# EAGLE schematic gyro_pcb (EAGLE 7.5.0)
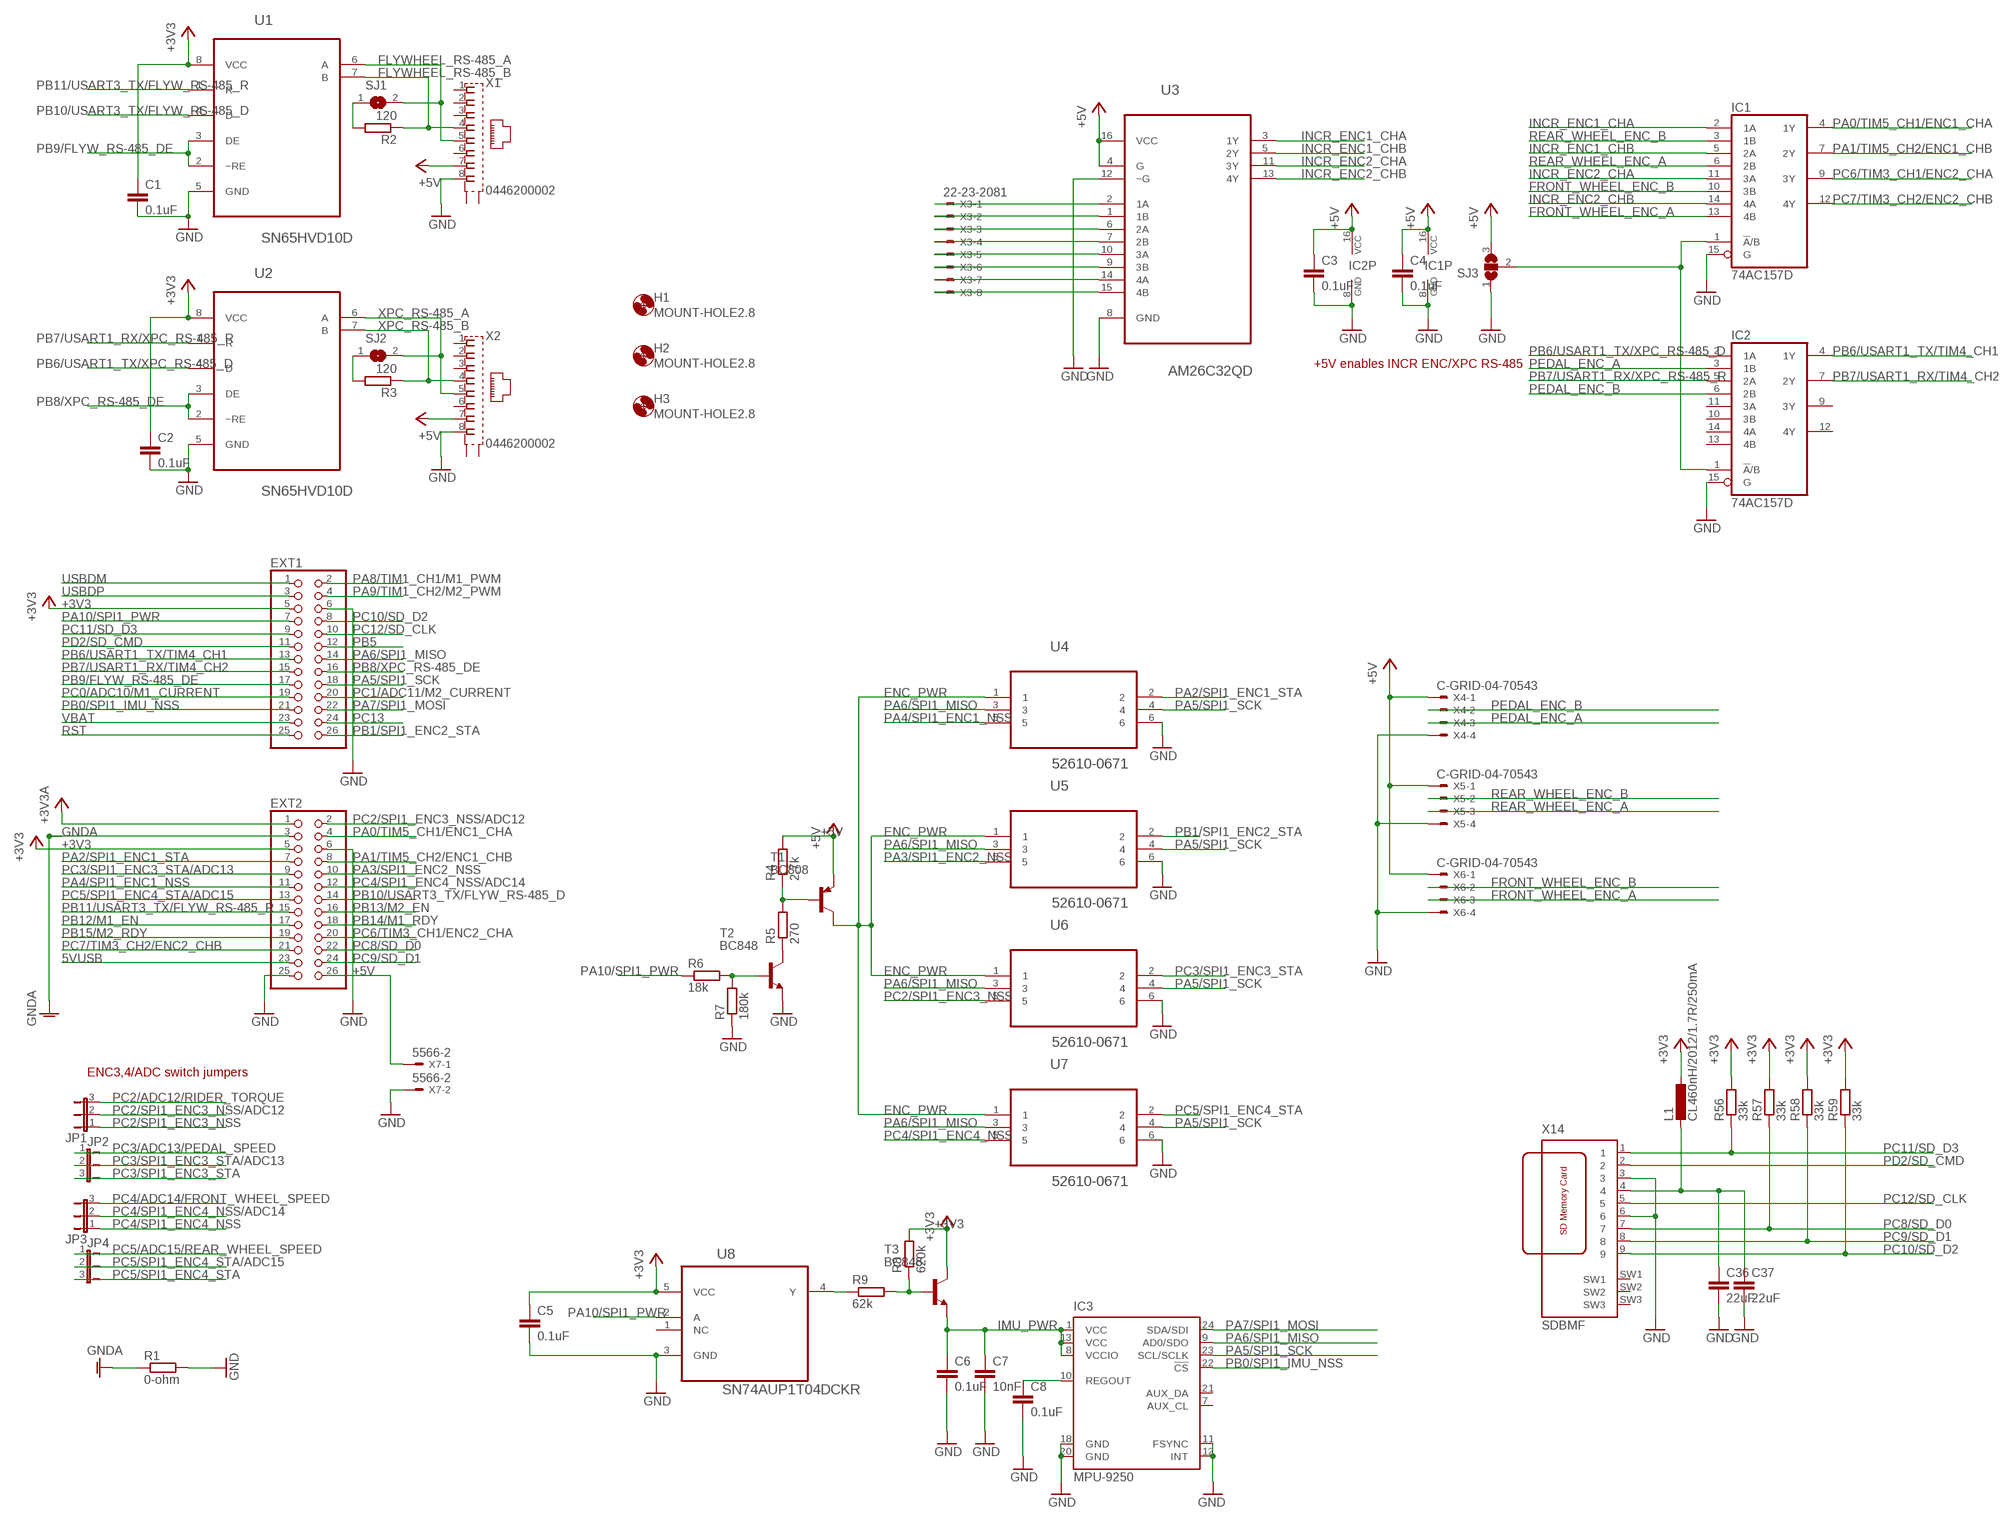
[diagram p0: schematic, sheet 1, part 1 of 2]
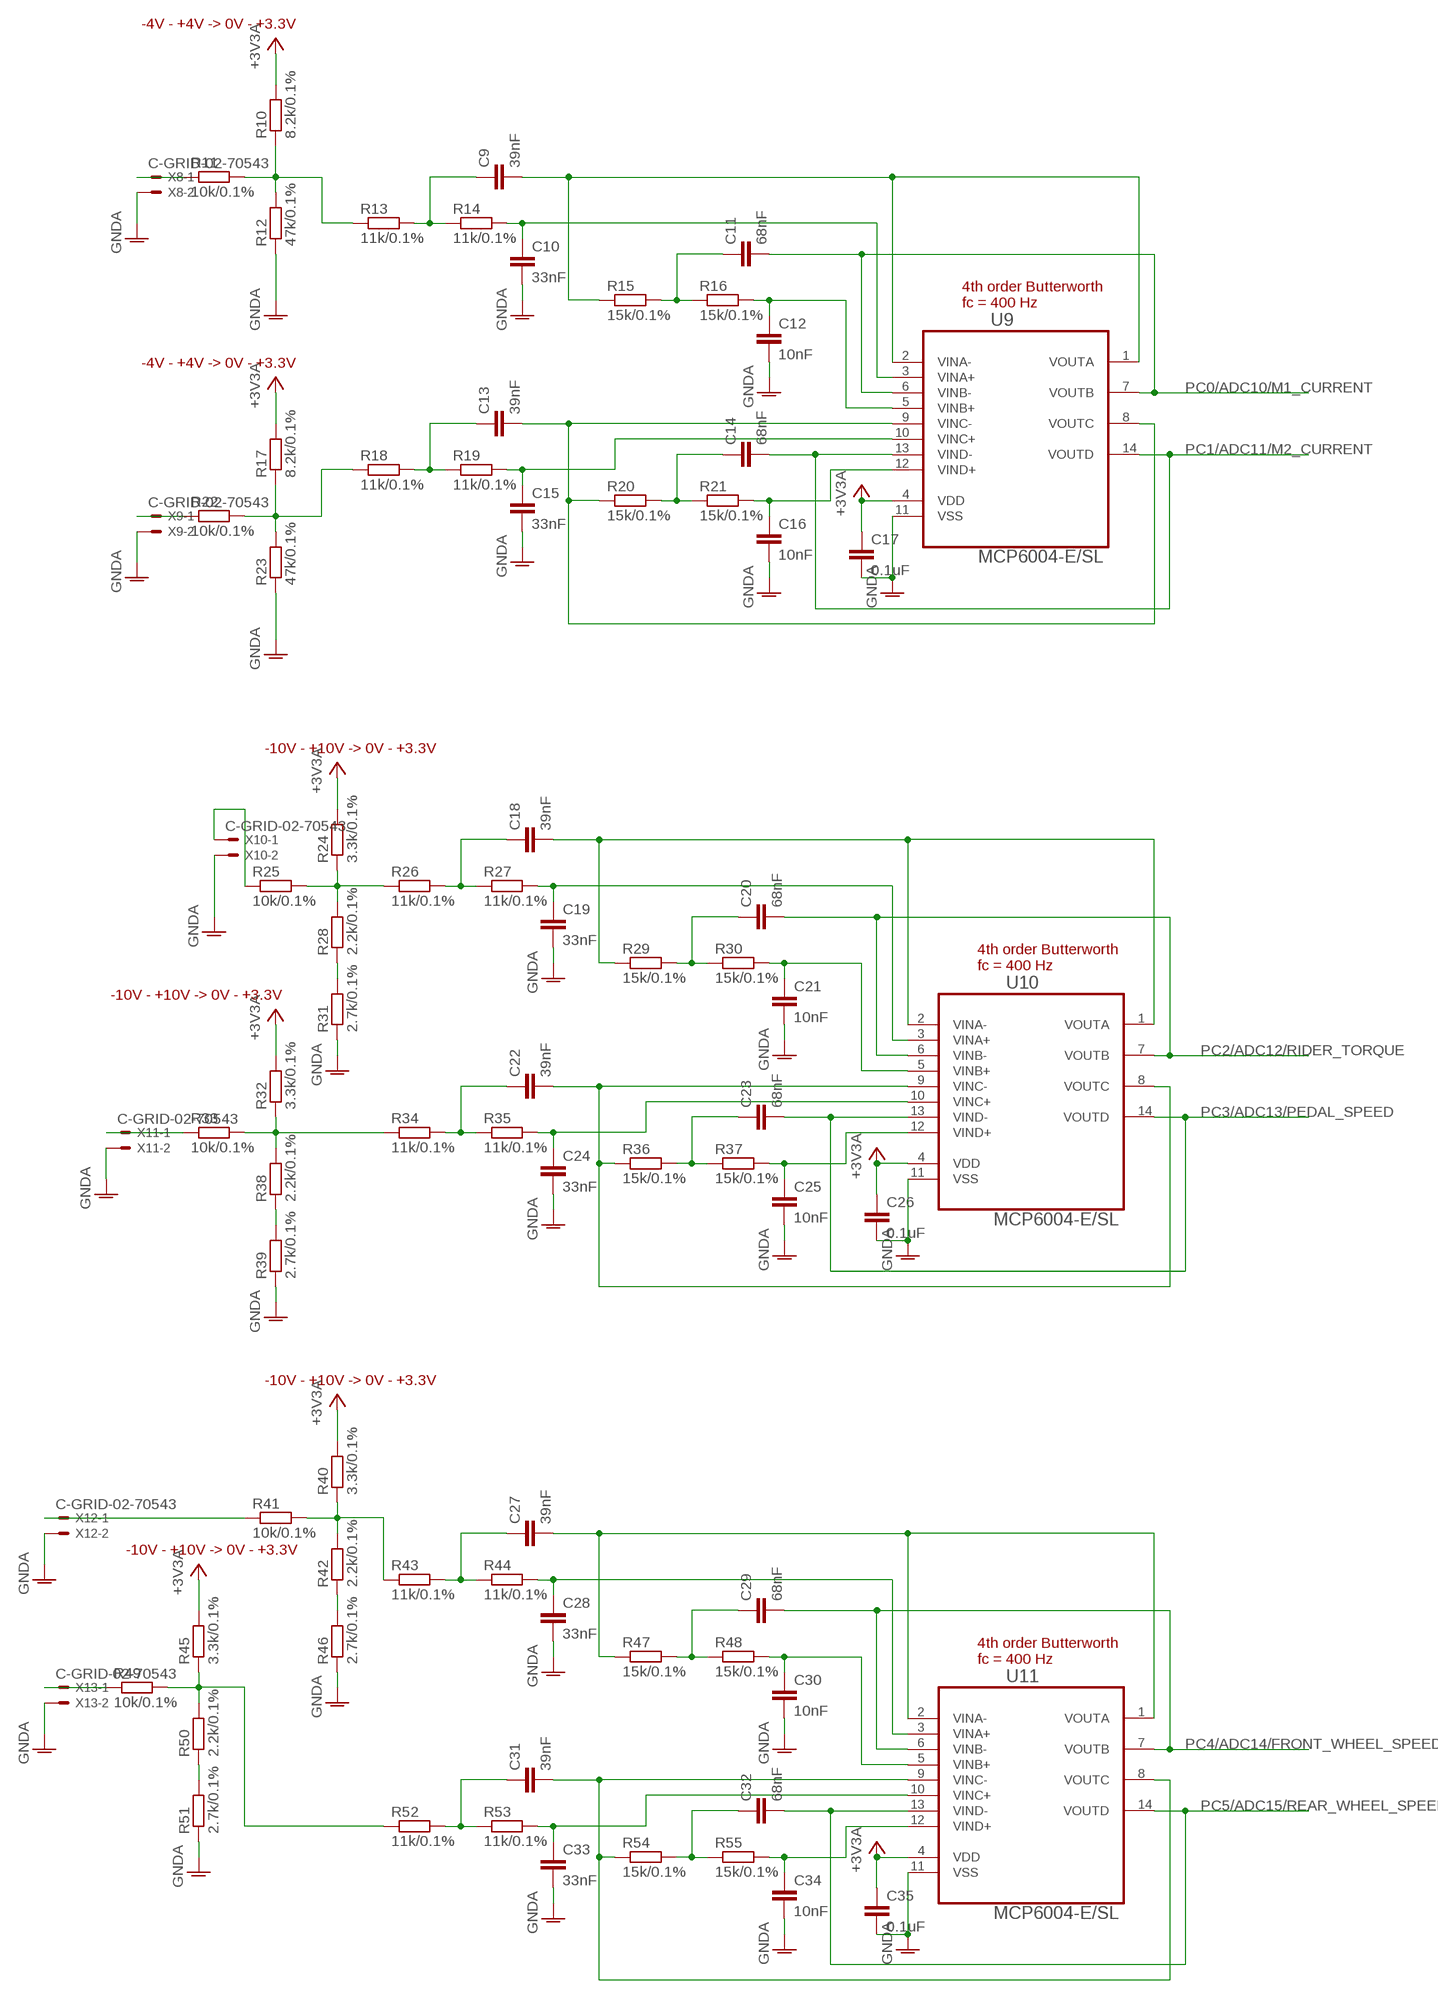
[diagram p1: schematic, sheet 1, part 2 of 2]

## Parts
C1  0.1uF  C-EUC0603  [C0603]
C2  0.1uF  C-EUC0603  [C0603]
C3  0.1uF  C-EUC0603  [C0603]
C4  0.1uF  C-EUC0603  [C0603]
C5  0.1uF  C-EUC0603  [C0603]
C6  0.1uF  C-EUC0603  [C0603]
C7  10nF  C-EUC0603  [C0603]
C8  0.1uF  C-EUC0603  [C0603]
C9  39nF  C-EUC0603  [C0603]
C10  33nF  C-EUC0603  [C0603]
C11  68nF  C-EUC0603  [C0603]
C12  10nF  C-EUC0603  [C0603]
C13  39nF  C-EUC0603  [C0603]
C14  68nF  C-EUC0603  [C0603]
C15  33nF  C-EUC0603  [C0603]
C16  10nF  C-EUC0603  [C0603]
C17  0.1uF  C-EUC0603  [C0603]
C18  39nF  C-EUC0603  [C0603]
C19  33nF  C-EUC0603  [C0603]
C20  68nF  C-EUC0603  [C0603]
C21  10nF  C-EUC0603  [C0603]
C22  39nF  C-EUC0603  [C0603]
C23  68nF  C-EUC0603  [C0603]
C24  33nF  C-EUC0603  [C0603]
C25  10nF  C-EUC0603  [C0603]
C26  0.1uF  C-EUC0603  [C0603]
C27  39nF  C-EUC0603  [C0603]
C28  33nF  C-EUC0603  [C0603]
C29  68nF  C-EUC0603  [C0603]
C30  10nF  C-EUC0603  [C0603]
C31  39nF  C-EUC0603  [C0603]
C32  68nF  C-EUC0603  [C0603]
C33  33nF  C-EUC0603  [C0603]
C34  10nF  C-EUC0603  [C0603]
C35  0.1uF  C-EUC0603  [C0603]
C36  22uF  C-EUC0603  [C0603]
C37  22uF  C-EUC0603  [C0603]
EXT1  PINHD-2X13  [2X13]
EXT2  PINHD-2X13  [2X13]
H1  MOUNT-HOLE2.8  [2,8]
H2  MOUNT-HOLE2.8  [2,8]
H3  MOUNT-HOLE2.8  [2,8]
IC1  74AC157D  [SO16]
IC2  74AC157D  [SO16]
IC3  MPU-9250  [QFN24-SMALL]
JP1  JP2E  [JP2]
JP2  JP2E  [JP2]
JP3  JP2E  [JP2]
JP4  JP2E  [JP2]
L1  CL460nH/2012/1.7R/250mA  L-EUL2825P  [L2825P]
R1  0-ohm  R-EU_R1218  [R1218]
R2  120  R-EU_R0603  [R0603]
R3  120  R-EU_R0603  [R0603]
R4  2.7k  R-EU_R1210  [R1210]
R5  270  R-EU_R1210  [R1210]
R6  18k  R-EU_R0603  [R0603]
R7  180k  R-EU_R0603  [R0603]
R8  620k  R-EU_R0603  [R0603]
R9  62k  R-EU_R0603  [R0603]
R10  8.2k/0.1%  R-EU_R0603  [R0603]
R11  10k/0.1%  R-EU_R0603  [R0603]
R12  47k/0.1%  R-EU_R0603  [R0603]
R13  11k/0.1%  R-EU_R0603  [R0603]
R14  11k/0.1%  R-EU_R0603  [R0603]
R15  15k/0.1%  R-EU_R0603  [R0603]
R16  15k/0.1%  R-EU_R0603  [R0603]
R17  8.2k/0.1%  R-EU_R0603  [R0603]
R18  11k/0.1%  R-EU_R0603  [R0603]
R19  11k/0.1%  R-EU_R0603  [R0603]
R20  15k/0.1%  R-EU_R0603  [R0603]
R21  15k/0.1%  R-EU_R0603  [R0603]
R22  10k/0.1%  R-EU_R0603  [R0603]
R23  47k/0.1%  R-EU_R0603  [R0603]
R24  3.3k/0.1%  R-EU_R0603  [R0603]
R25  10k/0.1%  R-EU_R0603  [R0603]
R26  11k/0.1%  R-EU_R0603  [R0603]
R27  11k/0.1%  R-EU_R0603  [R0603]
R28  2.2k/0.1%  R-EU_R0603  [R0603]
R29  15k/0.1%  R-EU_R0603  [R0603]
R30  15k/0.1%  R-EU_R0603  [R0603]
R31  2.7k/0.1%  R-EU_R0603  [R0603]
R32  3.3k/0.1%  R-EU_R0603  [R0603]
R33  10k/0.1%  R-EU_R0603  [R0603]
R34  11k/0.1%  R-EU_R0603  [R0603]
R35  11k/0.1%  R-EU_R0603  [R0603]
R36  15k/0.1%  R-EU_R0603  [R0603]
R37  15k/0.1%  R-EU_R0603  [R0603]
R38  2.2k/0.1%  R-EU_R0603  [R0603]
R39  2.7k/0.1%  R-EU_R0603  [R0603]
R40  3.3k/0.1%  R-EU_R0603  [R0603]
R41  10k/0.1%  R-EU_R0603  [R0603]
R42  2.2k/0.1%  R-EU_R0603  [R0603]
R43  11k/0.1%  R-EU_R0603  [R0603]
R44  11k/0.1%  R-EU_R0603  [R0603]
R45  3.3k/0.1%  R-EU_R0603  [R0603]
R46  2.7k/0.1%  R-EU_R0603  [R0603]
R47  15k/0.1%  R-EU_R0603  [R0603]
R48  15k/0.1%  R-EU_R0603  [R0603]
R49  10k/0.1%  R-EU_R0603  [R0603]
R50  2.2k/0.1%  R-EU_R0603  [R0603]
R51  2.7k/0.1%  R-EU_R0603  [R0603]
R52  11k/0.1%  R-EU_R0603  [R0603]
R53  11k/0.1%  R-EU_R0603  [R0603]
R54  15k/0.1%  R-EU_R0603  [R0603]
R55  15k/0.1%  R-EU_R0603  [R0603]
R56  33k  R-EU_R0603  [R0603]
R57  33k  R-EU_R0603  [R0603]
R58  33k  R-EU_R0603  [R0603]
R59  33k  R-EU_R0603  [R0603]
SJ1  SJ  [SJ]
SJ2  SJ  [SJ]
SJ3  SJ2W  [SJ_2]
T1  BC808  BC808-16-PNP-SOT23-BEC  [SOT23-BEC]
T2  BC848  [SOT23]
T3  BC848  [SOT23]
U1  SN65HVD10D  [SOIC127P600X175-8N]
U2  SN65HVD10D  [SOIC127P600X175-8N]
U3  AM26C32QD  [SOIC127P600X175-16N]
U4  52610-0671  [MOLEX_52610-0671]
U5  52610-0671  [MOLEX_52610-0671]
U6  52610-0671  [MOLEX_52610-0671]
U7  52610-0671  [MOLEX_52610-0671]
U8  SN74AUP1T04DCKR  [SOT65P210X110-5N]
U9  MCP6004-E/SL  [SOIC127P600X175-14N]
U10  MCP6004-E/SL  [SOIC127P600X175-14N]
U11  MCP6004-E/SL  [SOIC127P600X175-14N]
X1  0446200002  [0446200002]
X2  0446200002  [0446200002]
X3  22-23-2081  [22-23-2081]
X4  C-GRID-04-70543  [70543-04]
X5  C-GRID-04-70543  [70543-04]
X6  C-GRID-04-70543  [70543-04]
X7  5566-2  [5566-2]
X8  C-GRID-02-70543  [70543-02]
X9  C-GRID-02-70543  [70543-02]
X10  C-GRID-02-70543  [70543-02]
X11  C-GRID-02-70543  [70543-02]
X12  C-GRID-02-70543  [70543-02]
X13  C-GRID-02-70543  [70543-02]
X14  SDBMF  [SDBMF-009XXBXX2]

## Nets
5VUSB: EXT2.23
+3V3: C1.1 C2.1 C5.1 EXT1.5 EXT2.5 L1.1 R8.2 R56.2 R57.2 R58.2 R59.2 T3.3(C) U1.8(VCC) U2.8(VCC) U8.5(VCC)
+3V3A: C17.1 C26.1 C35.1 EXT2.1 R10.2 R17.2 R24.2 R32.2 R40.2 R45.2 U9.4(VDD) U10.4(VDD) U11.4(VDD)
+5V: C3.1 C4.1 EXT2.26 IC1.16(VCC) IC2.16(VCC) R4.2 SJ3.3 T1.E U3.4(G) U3.16(VCC) X1.7 X2.7 X4.1 X5.1 X6.1 X7.1
ENC1_CHA+: U3.1(1B) X3.2
ENC1_CHA-: U3.2(1A) X3.1
ENC1_CHB+: U3.7(2B) X3.4
ENC1_CHB-: U3.6(2A) X3.3
ENC2_CHA+: U3.9(3B) X3.6
ENC2_CHA-: U3.10(3A) X3.5
ENC2_CHB+: U3.15(4B) X3.8
ENC2_CHB-: U3.14(4A) X3.7
ENC_PWR: T1.C U4.1 U5.1 U6.1 U7.1
FLYWHEEL_RS-485_A: SJ1.2 U1.6(A) X1.5
FLYWHEEL_RS-485_B: R2.1 U1.7(B) X1.4
FRONT_WHEEL_ENC_A: IC1.13(4B) X6.3
FRONT_WHEEL_ENC_B: IC1.10(3B) X6.2
GND: C1.2 C2.2 C3.2 C4.2 C5.2 C6.2 C7.2 C8.2 C36.2 C37.2 EXT1.6 EXT2.6 EXT2.25 IC1.8(GND) IC1.15(G) IC2.8(GND) IC2.15(G) IC3.11(FSYNC) IC3.12(INT) IC3.18(GND) IC3.20(GND) R1.2 R7.1 SJ3.1 T2.2(E) U1.5(GND) U2.5(GND) U3.8(GND) U3.12(~G) U4.6 U5.6 U6.6 U7.6 U8.3(GND) X1.8 X2.8 X4.4 X5.4 X6.4 X7.2 X14.3 X14.6
GNDA: C10.2 C12.2 C15.2 C16.2 C17.2 C19.2 C21.2 C24.2 C25.2 C26.2 C28.2 C30.2 C33.2 C34.2 C35.2 EXT2.3 R1.1 R12.1 R23.1 R31.1 R39.1 R46.1 R51.1 U9.11(VSS) U10.11(VSS) U11.11(VSS) X8.2 X9.2 X10.2 X11.2 X12.2 X13.2
IMU_PWR: C6.1 C7.1 IC3.1(VCC) IC3.8(VCCIO) IC3.13(VCC) T3.2(E)
INCR_ENC1_CHA: IC1.2(1A) U3.3(1Y)
INCR_ENC1_CHB: IC1.5(2A) U3.5(2Y)
INCR_ENC2_CHA: IC1.11(3A) U3.11(3Y)
INCR_ENC2_CHB: IC1.14(4A) U3.13(4Y)
N$1: C8.1 IC3.10(REGOUT)
N$2: R8.1 R9.2 T3.1(B)
N$3: R4.1 R5.2 T1.B
N$4: R5.1 T2.3(C)
N$5: R6.2 R7.2 T2.1(B)
N$6: R28.1 R31.2
N$7: C18.1 R26.2 R27.1
N$8: C19.1 R27.2 U10.3(VINA+)
N$9: C18.2 R29.1 U10.1(VOUTA) U10.2(VINA-)
N$10: R24.1 R25.2 R26.1 R28.2
N$11: C22.1 R34.2 R35.1
N$12: C24.1 R35.2 U10.10(VINC+)
N$13: C22.2 R36.1 U10.8(VOUTC) U10.9(VINC-)
N$14: C23.1 R36.2 R37.1
N$15: R10.1 R11.2 R12.2 R13.1
N$16: R22.1 X9.1
N$17: R32.1 R33.2 R34.1 R38.2
N$18: C25.1 R37.2 U10.12(VIND+)
N$19: C36.1 C37.1 L1.2 X14.4
N$20: R2.2 SJ1.1
N$21: C9.1 R13.2 R14.1
N$22: C21.1 R30.2 U10.5(VINB+)
N$23: C20.1 R29.2 R30.1
N$24: R3.2 SJ2.1
N$25: C27.1 R43.2 R44.1
N$26: C28.1 R44.2 U11.3(VINA+)
N$27: C27.2 R47.1 U11.1(VOUTA) U11.2(VINA-)
N$28: C10.1 R14.2 U9.3(VINA+)
N$29: C9.2 R15.1 U9.1(VOUTA) U9.2(VINA-)
N$31: C12.1 R16.2 U9.5(VINB+)
N$32: C13.1 R18.2 R19.1
N$33: C15.1 R19.2 U9.10(VINC+)
N$34: C13.2 R20.1 U9.8(VOUTC) U9.9(VINC-)
N$35: C14.1 R20.2 R21.1
N$36: C16.1 R21.2 U9.12(VIND+)
N$37: R9.1 U8.4(Y)
N$38: C31.1 R52.2 R53.1
N$39: C33.1 R53.2 U11.10(VINC+)
N$40: C31.2 R54.1 U11.8(VOUTC) U11.9(VINC-)
N$41: C32.1 R54.2 R55.1
N$42: R49.1 X13.1
N$43: C34.1 R55.2 U11.12(VIND+)
N$44: C30.1 R48.2 U11.5(VINB+)
N$45: R17.1 R18.1 R22.2 R23.2
N$46: C29.1 R47.2 R48.1
N$47: R41.1 X12.1
N$48: C11.1 R15.2 R16.1
N$49: IC1.1(!A!/B) IC2.1(!A!/B) SJ3.2
N$50: R25.1 X10.1
N$53: R11.1 X8.1
N$58: R38.1 R39.2
N$59: R40.1 R41.2 R42.2 R43.1
N$60: R42.1 R46.2
N$61: R45.1 R49.2 R50.2 R52.1
N$62: R50.1 R51.2
N$63: R33.1 X11.1
PA0/TIM5_CH1/ENC1_CHA: EXT2.4 IC1.4(1Y)
PA1/TIM5_CH2/ENC1_CHB: EXT2.8 IC1.7(2Y)
PA2/SPI1_ENC1_STA: EXT2.7 U4.2
PA3/SPI1_ENC2_NSS: EXT2.10 U5.5
PA4/SPI1_ENC1_NSS: EXT2.11 U4.5
PA5/SPI1_SCK: EXT1.18 IC3.23(SCL/SCLK) U4.4 U5.4 U6.4 U7.4
PA6/SPI1_MISO: EXT1.14 IC3.9(AD0/SDO) U4.3 U5.3 U6.3 U7.3
PA7/SPI1_MOSI: EXT1.22 IC3.24(SDA/SDI)
PA8/TIM1_CH1/M1_PWM: EXT1.2
PA9/TIM1_CH2/M2_PWM: EXT1.4
PA10/SPI1_PWR: EXT1.7 R6.1 U8.2(A)
PB0/SPI1_IMU_NSS: EXT1.21 IC3.22(!CS)
PB1/SPI1_ENC2_STA: EXT1.26 U5.2
PB5: EXT1.12
PB6/USART1_TX/TIM4_CH1: EXT1.13 IC2.4(1Y)
PB6/USART1_TX/XPC_RS-485_D: IC2.2(1A) U2.4(D)
PB7/USART1_RX/TIM4_CH2: EXT1.15 IC2.7(2Y)
PB7/USART1_RX/XPC_RS-485_R: IC2.5(2A) U2.1(R)
PB8/XPC_RS-485_DE: EXT1.16 U2.2(~RE) U2.3(DE)
PB9/FLYW_RS-485_DE: EXT1.17 U1.2(~RE) U1.3(DE)
PB10/USART3_TX/FLYW_RS-485_D: EXT2.14 U1.4(D)
PB11/USART3_TX/FLYW_RS-485_R: EXT2.15 U1.1(R)
PB12/M1_EN: EXT2.17
PB13/M2_EN: EXT2.16
PB14/M1_RDY: EXT2.18
PB15/M2_RDY: EXT2.19
PC0/ADC10/M1_CURRENT: C11.2 EXT1.19 U9.6(VINB-) U9.7(VOUTB)
PC1/ADC11/M2_CURRENT: C14.2 EXT1.20 U9.13(VIND-) U9.14(VOUTD)
PC2/ADC12/RIDER_TORQUE: C20.2 JP1.3 U10.6(VINB-) U10.7(VOUTB)
PC2/SPI1_ENC3_NSS: JP1.1 U6.5
PC2/SPI1_ENC3_NSS/ADC12: EXT2.2 JP1.2
PC3/ADC13/PEDAL_SPEED: C23.2 JP2.1 U10.13(VIND-) U10.14(VOUTD)
PC3/SPI1_ENC3_STA: JP2.3 U6.2
PC3/SPI1_ENC3_STA/ADC13: EXT2.9 JP2.2
PC4/ADC14/FRONT_WHEEL_SPEED: C29.2 JP3.3 U11.6(VINB-) U11.7(VOUTB)
PC4/SPI1_ENC4_NSS: JP3.1 U7.5
PC4/SPI1_ENC4_NSS/ADC14: EXT2.12 JP3.2
PC5/ADC15/REAR_WHEEL_SPEED: C32.2 JP4.1 U11.13(VIND-) U11.14(VOUTD)
PC5/SPI1_ENC4_STA: JP4.3 U7.2
PC5/SPI1_ENC4_STA/ADC15: EXT2.13 JP4.2
PC6/TIM3_CH1/ENC2_CHA: EXT2.20 IC1.9(3Y)
PC7/TIM3_CH2/ENC2_CHB: EXT2.21 IC1.12(4Y)
PC8/SD_D0: EXT2.22 R57.1 X14.7
PC9/SD_D1: EXT2.24 R58.1 X14.8
PC10/SD_D2: EXT1.8 R59.1 X14.9
PC11/SD_D3: EXT1.9 R56.1 X14.1
PC12/SD_CLK: EXT1.10 X14.5
PC13: EXT1.24
PD2/SD_CMD: EXT1.11 X14.2
PEDAL_ENC_A: IC2.3(1B) X4.3
PEDAL_ENC_B: IC2.6(2B) X4.2
REAR_WHEEL_ENC_A: IC1.6(2B) X5.3
REAR_WHEEL_ENC_B: IC1.3(1B) X5.2
RST: EXT1.25
USBDM: EXT1.1
USBDP: EXT1.3
VBAT: EXT1.23
XPC_RS-485_A: SJ2.2 U2.6(A) X2.5
XPC_RS-485_B: R3.1 U2.7(B) X2.4
Unconnected: IC2.9(3Y) IC2.10(3B) IC2.11(3A) IC2.12(4Y) IC2.13(4B) IC2.14(4A) IC3.7(AUX_CL) IC3.21(AUX_DA) U8.1(NC) X1.1 X1.2 X1.3 X1.6 X1.S@1(S1) X1.S@2(S2) X2.1 X2.2 X2.3 X2.6 X2.S@1(S1) X2.S@2(S2) X14.SW1 X14.SW2 X14.SW3

## Notes on the sheet
- -4V - +4V -> 0V - +3.3V
- 4th order Butterworth
  fc = 400 Hz
- +5V enables INCR ENC/XPC RS-485
- -4V - +4V -> 0V - +3.3V
- -10V - +10V -> 0V - +3.3V
- 4th order Butterworth
  fc = 400 Hz
- -10V - +10V -> 0V - +3.3V
- ENC3,4/ADC switch jumpers
- -10V - +10V -> 0V - +3.3V
- -10V - +10V -> 0V - +3.3V
- 4th order Butterworth
  fc = 400 Hz

## Library data of the parts
C1-C37 = rcl:C-EU: CAPACITOR, European symbol
EXT1 EXT2 = pinhead:PINHD-2X13: PIN HEADER
H1-H3 = holes:MOUNT-HOLE: MOUNTING HOLE with drill center marker
IC1 IC2 = 74xx-eu:74*157: Quadruple 2-line to 1-line data SELECTOR/MULTIPLEXER
IC3 = invensense:MPU-9250: 9-axis MotionTracking device communicate with I2C/SPI Source: http://www.invensense.com/mems/gyro/documents/PS-MPU-9250A-01.pdf
JP1-JP4 = jumper:JP2E: JUMPER
L1 = rcl:L-EU: INDUCTOR, European symbol
R1-R59 = rcl:R-EU_: RESISTOR, European symbol
SJ1 SJ2 = jumper:SJ: SMD solder JUMPER
SJ3 = jumper:SJ2W: SMD solder JUMPER
T1 = transistor:*-PNP-: PNP Transistror
T2 T3 = transistor:BC848: NPN TRANSISTOR
U1 U2 = Texas Instruments_By_element14_Batch_1:SN65HVD10D: 3.3-V RS-485 TRANSCEIVERS; MPN: SN65HVD10D; OC_FARNELL: 1207267; OC_NEWARK: 72K9420; PACKAGE: SOIC-8; SUPPLIER: Texas Instruments
U3 = Texas Instruments_By_element14_Batch_1:AM26C32QD: QUADRUPLE DIFFERENTIAL LINE RECEIVER; MPN: AM26C32QD; OC_FARNELL: -; OC_NEWARK: 50R9732; PACKAGE: SOIC-16; SUPPLIER: Texas Instruments
U4-U7 = Molex_By_element14_Batch_1:52610-0671: SOCKET FFC/FPC; MPN: 52610-0671; OC_FARNELL: 1079958; OC_NEWARK: 07P8569; PACKAGE: SOCKET FFC/FPC, 06 way; SUPPLIER: Molex
U8 = Texas Instruments_By_element14_Batch_1:SN74AUP1T04DCKR: LOW POWER, 1.8/2.5/3.3-V INPUT, 3.3-V CMOS OUTPUT, SINGLE INVERTER GATE; MPN: SN74AUP1T04DCKR; OC_FARNELL: -; OC_NEWARK: 74R6552; PACKAGE: SC70-5; SUPPLIER: Texas Instruments
U9-U11 = Microchip_By_element14_Batch_1:MCP6004-E/SL: IC, OP AMP, QUAD 1MHZ, SMD,; MPN: MCP6004-E/SL; OC_FARNELL: 1332122; OC_NEWARK: 34M7475; PACKAGE: SOIC14; SUPPLIER: Microchip
X1 X2 = con-molex:0446200002: RJ-45 INVERTED MODULAR JACK ASSEMBLY WITH RJ-11 KEEPOUT FEATURE Source: Data sheet <http://www.farnell.com/datasheets/73207.pdf> MOLEX 0446200002 BUCHSE, RJ45, GESCHIRMT Source: Farnell <http://de.farnell.com/molex/0446200002/buchse-rj45-geschirmt/dp/9251910?ost=9251910>; MF: MOLEX; MPN: 0446200002; OC_FARNELL: 9251910
X3 = con-molex:22-23-2081: .100" (2.54mm) Center Header - 8 Pin; MF: MOLEX; MPN: 22-23-2081; OC_FARNELL: 1756826; OC_NEWARK: 01C7592
X4-X6 = con-molex:C-GRID-04: CONNECTOR wire to board 2.54 mm (0.100") pitch header; OC_FARNELL: unknown; OC_NEWARK: unknown
X7 = con-molex:5566-2: Mini FIT connector 2 pol Source: http://www.molex.com; OC_FARNELL: 1822072; OC_NEWARK: unknown
X8-X13 = con-molex:C-GRID-02: CONNECTOR wire to board 2.54 mm (0.100") pitch header; OC_FARNELL: unknown; OC_NEWARK: unknown
X14 = farnell:SDBMF: SD MEMORY CARD PUSH-PUSH WITH CONNECTOR TYPE B (BIG SWUÌTCH #3) KINGFONT PRECISION INDUSTIAL CO., LTD Source: http://www.farnell.com/datasheets/74273.pdf Best.-Nr.: 9186174 Hersteller: MULTICOMP Herstellerbez.: SDBMF-00915B0T2